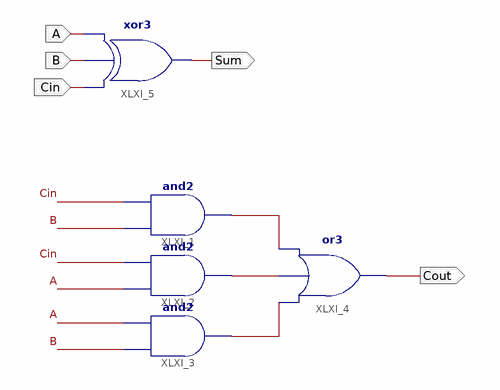
[diagram p0: schematic sheet 1]
// Xilinx ISE schematic myFullAdder.sch (aspartan6) as structural Verilog: 5 symbols, 5 ports
module myFullAdder (
  input  Cin,
  input  B,
  input  A,
  output Cout,
  output Sum
);

  wire XLXN_1, XLXN_2, XLXN_4;

  and XLXI_1 (XLXN_1, B, Cin);
  and XLXI_2 (XLXN_2, A, Cin);
  and XLXI_3 (XLXN_4, B, A);
  or XLXI_4 (Cout, XLXN_4, XLXN_2, XLXN_1);
  xor XLXI_5 (Sum, Cin, B, A);
endmodule
